# EAGLE schematic mcu_v03 (EAGLE 6.1)
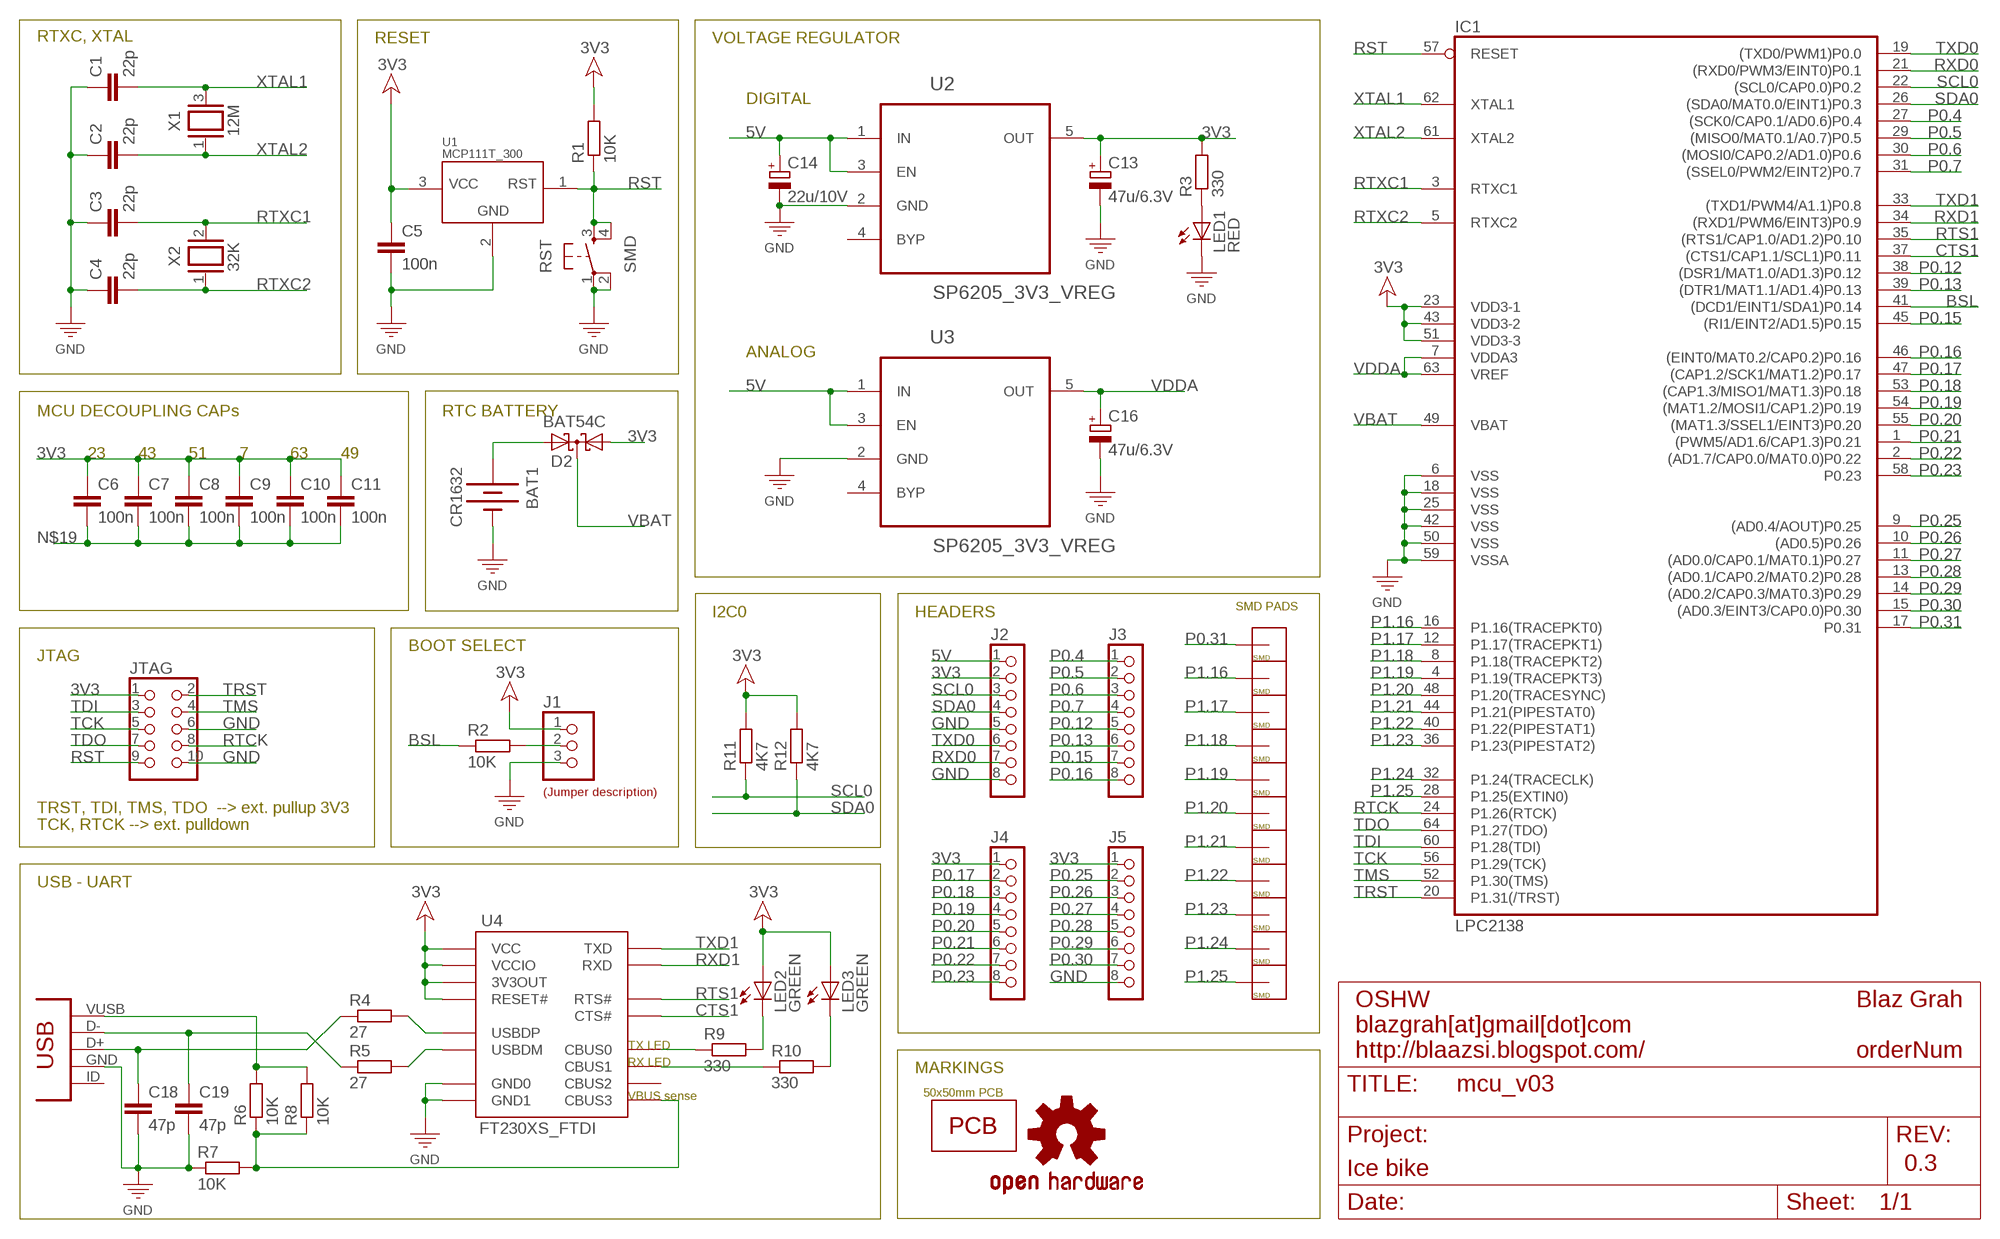
[diagram p0: schematic, sheet 1]

## Parts
BAT1  CR1632  BATTERY  [BATTERY_16MM_SDM]
C1  22p  C-EUC0603  [C0603]
C2  22p  C-EUC0603  [C0603]
C3  22p  C-EUC0603  [C0603]
C4  22p  C-EUC0603  [C0603]
C5  100n  C-EUC0603  [C0603]
C6  100n  C-EUC0603  [C0603]
C7  100n  C-EUC0603  [C0603]
C8  100n  C-EUC0603  [C0603]
C9  100n  C-EUC0603  [C0603]
C10  100n  C-EUC0603  [C0603]
C11  100n  C-EUC0603  [C0603]
C13  47u/6.3V  CAPACITOR_POL-SMC_B  [SMC_B]
C14  22u/10V  CAPACITOR_POL-SMC_B  [SMC_B]
C16  47u/6.3V  CAPACITOR_POL-SMC_B  [SMC_B]
C18  47p  C-EUC0603  [C0603]
C19  47p  C-EUC0603  [C0603]
D2  BAT54C  [SOT23]
IC1  LPC2138  LCP2138_LQFP64  [LQFP64]
J1  JUMPER_1X3ALT  [JUMPER_SOLDER]
J2  CON_HEADER_1X08-PTH  [M1X8]
J3  CON_HEADER_1X08-PTH  [M1X8]
J4  CON_HEADER_1X08-PTH  [M1X8]
J5  CON_HEADER_1X08-PTH  [M1X8]
JTAG  CON_HEADER_2X05-PTH+SHROUDED_A  [PINSHRD_PTH_2X05]
LED1  RED  LED0603  [LED-0603]
LED2  GREEN  LED0603  [LED-0603]
LED3  GREEN  LED0603  [LED-0603]
PCB1  PCB_DP_SQUARE-5X5  [PCB5X5]
R1  10K  R-EU0603  [R0603]
R2  10K  R-EU0603  [R0603]
R3  330  R-EU0603  [R0603]
R4  27  R-EU0603  [R0603]
R5  27  R-EU0603  [R0603]
R6  10K  R-EU0603  [R0603]
R7  10K  R-EU0603  [R0603]
R8  10K  R-EU0603  [R0603]
R9  330  R-EU0603  [R0603]
R10  330  R-EU0603  [R0603]
R11  4K7  R-EU0603  [R0603]
R12  4K7  R-EU0603  [R0603]
RST  SMD  TACTIL_BUTTON  [BUTTON_SW_4P_SMD]
U1  MCP111T_300  [SOT23]
U2  SP6205_3V3_VREG  [SOT23-5]
U3  SP6205_3V3_VREG  [SOT23-5]
U4  FT230XS_FTDI  [SSOP16]
U$11  LABEL_JUMPER_1X3  [JUMP3_DESC]
U$13  FRAME_DINA4_L  [DP_LOGO]
U$17  OSHW-LOGOS  [OSHW-LOGO-S]
U$28  CON_SMD_PAD_1X1  [CON_SMD_PAD_1_]
U$29  CON_SMD_PAD_1X1  [CON_SMD_PAD_1_]
U$30  CON_SMD_PAD_1X1  [CON_SMD_PAD_1_]
U$31  CON_SMD_PAD_1X1  [CON_SMD_PAD_1_]
U$32  CON_SMD_PAD_1X1  [CON_SMD_PAD_1_]
U$33  CON_SMD_PAD_1X1  [CON_SMD_PAD_1_]
U$34  CON_SMD_PAD_1X1  [CON_SMD_PAD_1_]
U$35  CON_SMD_PAD_1X1  [CON_SMD_PAD_1_]
U$36  CON_SMD_PAD_1X1  [CON_SMD_PAD_1_]
U$37  CON_SMD_PAD_1X1  [CON_SMD_PAD_1_]
U$38  CON_SMD_PAD_1X1  [CON_SMD_PAD_1_]
USB1  CON-USB-F-MINI-B  [CONN_USB_MINI-B]
X1  12M  CRYSTAL12MHZ  [ABMM2_6X3.6]
X2  32K  CRYSTAL32KHZ  [ABS10_4.9X1.8]

## Nets
3V3: C5.1 C6.1 C7.1 C8.1 C9.1 C10.1 C11.1 C13.+ D2.1(A1) IC1.23(VDD3-1) IC1.43(VDD3-2) IC1.51(VDD3-3) J1.1 J2.2 J4.1 J5.1 JTAG.1 LED2.A LED3.A R1.2 R3.2 R11.2 R12.2 U1.3(VCC) U2.5(OUT) U4.P$3(VCCIO) U4.P$10(3V3OUT) U4.P$11(RESET#) U4.P$12(VCC)
5V: C14.+ J2.1 U2.1(IN) U2.3(EN) U3.1(IN) U3.3(EN)
BSL: IC1.41((DCD1/EINT1/SDA1)P0.14) R2.1
CTS1: IC1.37((CTS1/CAP1.1/SCL1)P0.11) U4.P$6(CTS#)
GND: BAT1.NEG C1.1 C2.1 C3.1 C4.1 C5.2 C13.- C14.- C16.- C18.2 C19.2 IC1.6(VSS) IC1.18(VSS) IC1.25(VSS) IC1.42(VSS) IC1.50(VSS) IC1.59(VSSA) J1.3 J2.5 J2.8 J5.8 JTAG.6 JTAG.10 LED1.C R7.1 RST.1 RST.2 U1.2(GND) U2.2(GND) U3.2(GND) U4.P$5(GND0) U4.P$13(GND1) USB1.GND
N$1: J1.2 R2.2
N$4: LED1.A R3.1
N$5: BAT1.POS1(POZ) BAT1.POS2(POZ) D2.2(A2)
N$6: C19.1 R5.1 USB1.D-
N$7: C18.1 R4.1 USB1.D+
N$8: R5.2 U4.P$9(USBDM)
N$9: R4.2 U4.P$8(USBDP)
N$10: R6.2 R8.2 USB1.VUSB
N$11: R6.1 R7.2 R8.1 U4.P$16(CBUS3)
N$12: R10.1 U4.P$14(CBUS1)
N$13: LED2.C R9.2
N$14: LED3.C R10.2
N$15: R9.1 U4.P$15(CBUS0)
N$19: C6.2 C7.2 C8.2 C9.2 C10.2 C11.2
P0.4: IC1.27((SCK0/CAP0.1/AD0.6)P0.4) J3.1
P0.5: IC1.29((MISO0/MAT0.1/A0.7)P0.5) J3.2
P0.6: IC1.30((MOSI0/CAP0.2/AD1.0)P0.6) J3.3
P0.7: IC1.31((SSEL0/PWM2/EINT2)P0.7) J3.4
P0.12: IC1.38((DSR1/MAT1.0/AD1.3)P0.12) J3.5
P0.13: IC1.39((DTR1/MAT1.1/AD1.4)P0.13) J3.6
P0.15: IC1.45((RI1/EINT2/AD1.5)P0.15) J3.7
P0.16: IC1.46((EINT0/MAT0.2/CAP0.2)P0.16) J3.8
P0.17: IC1.47((CAP1.2/SCK1/MAT1.2)P0.17) J4.2
P0.18: IC1.53((CAP1.3/MISO1/MAT1.3)P0.18) J4.3
P0.19: IC1.54((MAT1.2/MOSI1/CAP1.2)P0.19) J4.4
P0.20: IC1.55((MAT1.3/SSEL1/EINT3)P0.20) J4.5
P0.21: IC1.1((PWM5/AD1.6/CAP1.3)P0.21) J4.6
P0.22: IC1.2((AD1.7/CAP0.0/MAT0.0)P0.22) J4.7
P0.23: IC1.58(P0.23) J4.8
P0.25: IC1.9((AD0.4/AOUT)P0.25) J5.2
P0.26: IC1.10((AD0.5)P0.26) J5.3
P0.27: IC1.11((AD0.0/CAP0.1/MAT0.1)P0.27) J5.4
P0.28: IC1.13((AD0.1/CAP0.2/MAT0.2)P0.28) J5.5
P0.29: IC1.14((AD0.2/CAP0.3/MAT0.3)P0.29) J5.6
P0.30: IC1.15((AD0.3/EINT3/CAP0.0)P0.30) J5.7
P0.31: IC1.17(P0.31) U$38.1
P1.16: IC1.16(P1.16(TRACEPKT0)) U$28.1
P1.17: IC1.12(P1.17(TRACEPKT1)) U$29.1
P1.18: IC1.8(P1.18(TRACEPKT2)) U$30.1
P1.19: IC1.4(P1.19(TRACEPKT3)) U$31.1
P1.20: IC1.48(P1.20(TRACESYNC)) U$32.1
P1.21: IC1.44(P1.21(PIPESTAT0)) U$33.1
P1.22: IC1.40(P1.22(PIPESTAT1)) U$34.1
P1.23: IC1.36(P1.23(PIPESTAT2)) U$35.1
P1.24: IC1.32(P1.24(TRACECLK)) U$36.1
P1.25: IC1.28(P1.25(EXTIN0)) U$37.1
RST: IC1.57(RESET) JTAG.9 R1.1 RST.3 RST.4 U1.1(RST)
RTCK: IC1.24(P1.26(RTCK)) JTAG.8
RTS1: IC1.35((RTS1/CAP1.0/AD1.2)P0.10) U4.P$2(RTS#)
RTXC1: C3.2 IC1.3(RTXC1) X2.2
RTXC2: C4.2 IC1.5(RTXC2) X2.1
RXD0: IC1.21((RXD0/PWM3/EINT0)P0.1) J2.7
RXD1: IC1.34((RXD1/PWM6/EINT3)P0.9) U4.P$4(RXD)
SCL0: IC1.22((SCL0/CAP0.0)P0.2) J2.3 R11.1
SDA0: IC1.26((SDA0/MAT0.0/EINT1)P0.3) J2.4 R12.1
TCK: IC1.56(P1.29(TCK)) JTAG.5
TDI: IC1.60(P1.28(TDI)) JTAG.3
TDO: IC1.64(P1.27(TDO)) JTAG.7
TMS: IC1.52(P1.30(TMS)) JTAG.4
TRST: IC1.20(P1.31(/TRST)) JTAG.2
TXD0: IC1.19((TXD0/PWM1)P0.0) J2.6
TXD1: IC1.33((TXD1/PWM4/A1.1)P0.8) U4.P$1(TXD)
VBAT: D2.3(CC) IC1.49(VBAT)
VDDA: C16.+ IC1.7(VDDA3) IC1.63(VREF) U3.5(OUT)
XTAL1: C1.2 IC1.62(XTAL1) X1.3
XTAL2: C2.2 IC1.61(XTAL2) X1.1
Unconnected: U2.4(BYP) U3.4(BYP) U4.P$7(CBUS2) USB1.BODY@1(BODY) USB1.BODY@2(BODY) USB1.BODY@3(BODY) USB1.BODY@4(BODY) USB1.ID(USBID)

## Notes on the sheet
- RTXC, XTAL | RESET | VOLTAGE REGULATOR
- DIGITAL
- ANALOG
- MCU DECOUPLING CAPs | RTC BATTERY
- 23 | 43 | 51 | 7 | 63 | 49
- SMD PADS
- I2C0 | HEADERS
- BOOT SELECT
- JTAG
- TRST, TDI, TMS, TDO  --> ext. pullup 3V3
- TCK, RTCK --> ext. pulldown
- USB - UART
- TX LED
- RX LED
- MARKINGS
- VBUS sense | 50x50mm PCB

## Library data of the parts
BAT1 = 00_beegee:BATTERY: BATTERY CONNECTORS
C1-C11 C18 C19 = 00_beegee:C-EU: CAPACITOR 22p ... 0603..... Farnell <http://si.farnell.com/multicomp/mcca000196/mlcc-0603-np0-50v-22pf/dp/1759057RL> ... 0.60€/100kom (dec. 2011) 100n .. 0603..... Farnell <http://si.farnell.com/multicomp/mcca000255/mlcc-0603-x7r-50v-100nf/dp/1759122> ... 0.60€/100kom (dec. 2011)
C13 C14 C16 = 10_dang_prototyps:CAPACITOR_POL: Polarized capacitor in various packages
D2 = diode:BAT54C: Schottky Diodes Source: Fairchild .. BAT54.pdf
IC1 = 00_beegee:LCP2138: NXP - LPC2138FBD64 32bit ARM7, 512k FLASH, LQFP64 ... Farnell <http://si.farnell.com/nxp/lpc2138fbd64/16-32bit-mcu-arm7-512k-flash-64lqfp/dp/1727704> ... 27.18€ (dec.2011)
J1 = 10_dang_prototyps:JUMPER_1X3; J12: USER; J23: BOOT
J2-J5 = 10_dang_prototyps:CON_HEADER_1X08
JTAG = 10_dang_prototyps:CON_HEADER_2X05: 2x05 pin header
LED1-LED3 = 11_SparkFun:LED: LEDs Standard schematic elements and footprints for 5mm, 3mm, 1206, and 0603 sized LEDs. 5mm - Spark Fun Electronics SKU : COM-00529 (and others)
PCB1 = 10_dang_prototyps:PCB_DP_SQUARE: Dangerous Prototypes Standard Square PCB sizes
R1-R12 = 00_beegee:R-EU: RESISTOR Resistors: 10k ... 0603 ... Farnell <http://si.farnell.com/panasonic/erj3geyj103v/resistor-0603-10k-5-0-1w/dp/2059627> ... 0.40€/50kom (dec.2011)
RST = 00_beegee:TACTIL_BUTTON
U1 = 00_beegee:MCP111T_300: Voltage supervissor Farnell: http://si.farnell.com/microchip/mcp111t-300e-tt/suppervisor-1ua-2-93v-sot-23b/dp/1605552RL 0,38€/1
U2 U3 = 01_farnell:SP6205_3V3_VREG; OC_FARNELL: 9388338; PACKAGE: SOT-23-5
U4 = 01_farnell:FT230XS_FTDI: USB to UART http://si.farnell.com/ftdi/ft230xs/i-f-usb2-0-fs-to-basic-uart-16ssop/dp/2081321?Ntt=ft230xs 1.56€/1
U$11 = 10_dang_prototyps:LABEL_JUMPER_1X3: Nice formatted three legged jumperdescription Use attributes to change the values LEFT = With jumper to the left RIGHT = With jumper to the right; LEFT: USER; RIGHT: BOOT
U$13 = 10_dang_prototyps:FRAME_DINA4_L: A4 DP frame Standard Dangerous Prototypes schematic frame. Automagically adds the DP logo and standard texts to the PCB Use the atrribute in the schematic editor to change the fields.; AUTHOR: Blaz Grah; LICENSE: OSHW; ORDER_NUM: orderNum; PROJECT: Ice bike; REV: 0.3; URL1: blazgrah[at]gmail[dot]com; URL2: http://blaazsi.blogspot.com/
U$17 = 11_SparkFun:OSHW-LOGO: Open Source Hardware Logo This logo indicates the piece of hardware it is found on incorporates a OSHW license and/or adheres to the definition of open source hardware found here: http://freedomdefined.org/OSHW
U$28-U$38 = 00_beegee:CON_SMD_PAD_1X1
USB1 = 10_dang_prototyps:CON-USB-F: USB Female connector
X1 X2 = 00_beegee:CRYSTAL: CRYSTAL